# Altium schematic sheet Flight Controller Support Board.SchDoc
size A4; SheetNumber: 1; SheetTotal: 1
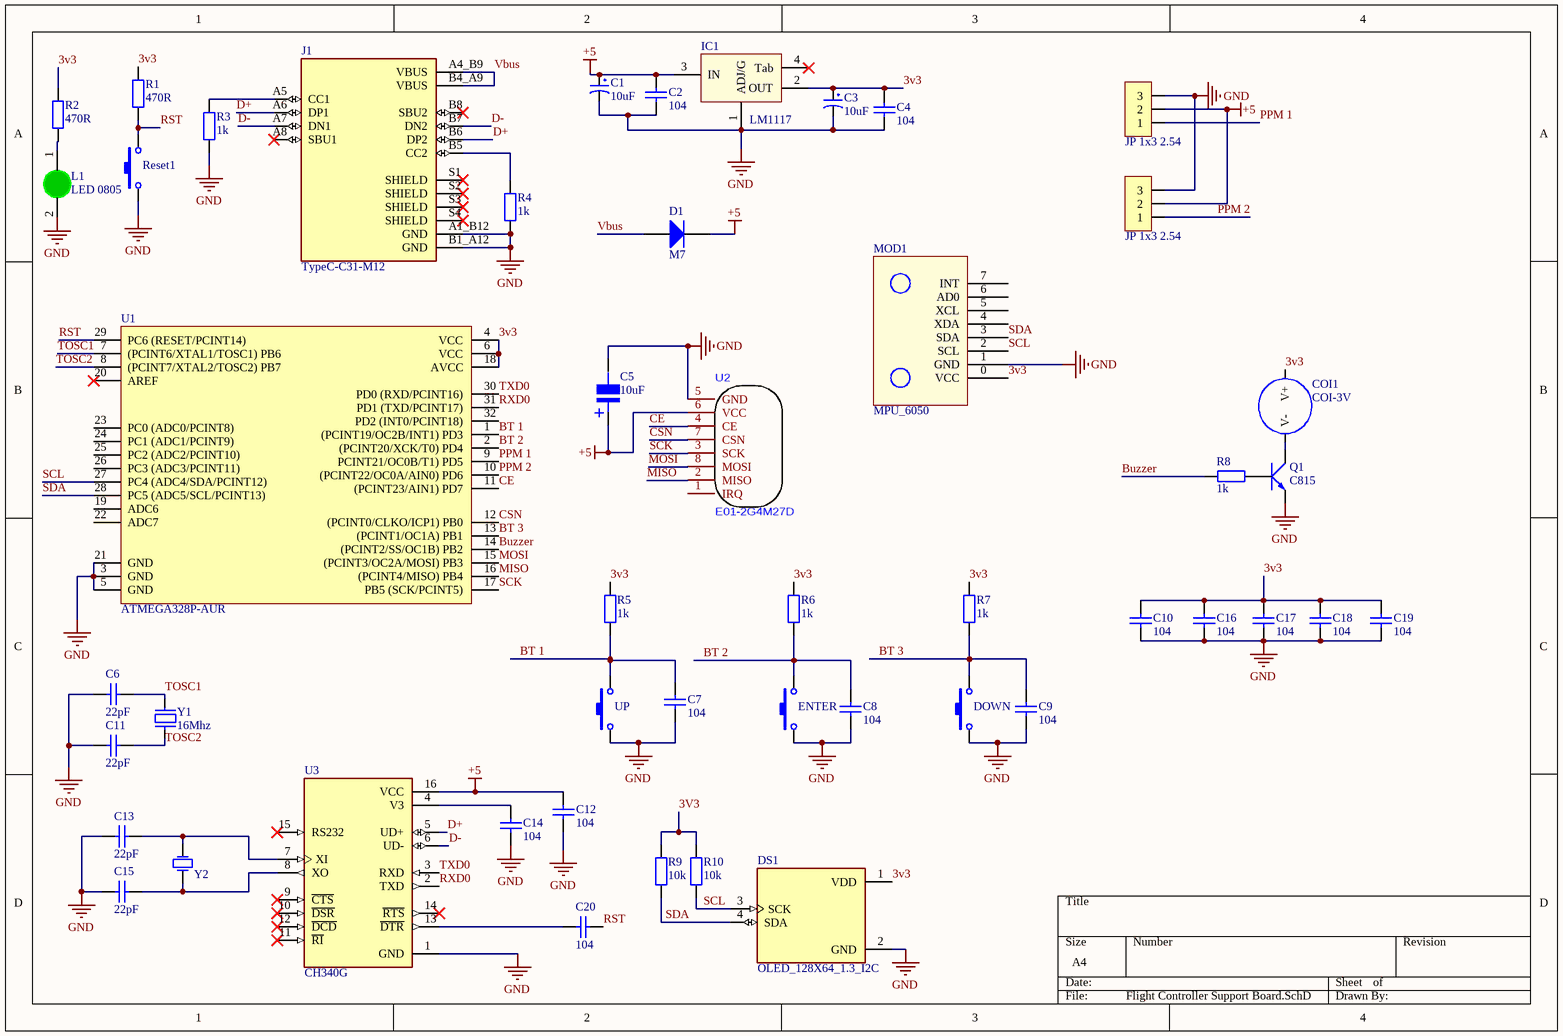
[diagram p0: Flight Controller Support Board.SchDoc]

## Parts
C1  10uF  [tu tantalum smd7343]
C2  104  [Cap 0603]
C3  10uF  [tu tantalum smd7343]
C4  104  [Cap 0603]
C5  10uF  [tu nhom 5 (c)]
C6  22pF  [tu 0603]
C7  104  [Cap 0603]
C8  104  [Cap 0603]
C9  104  [Cap 0603]
C10  104  [Cap 0603]
C11  22pF  [tu 0603]
C12  104  [Cap 0603]
C13  22pF  [tu 0603]
C14  104  [Cap 0603]
C15  22pF  [tu 0603]
C16  104  [Cap 0603]
C17  104  [Cap 0603]
C18  104  [Cap 0603]
C19  104  [Cap 0603]
C20  104  [Cap 0603]
COI1  COI-3V  [COI-CHIP - duplicate]
D1  M7  [DIODE SMA]
DOWN  Nut Nhan 2 Chan SMD 3x6x2.5  [Nut Nhan 2 Chan SMD 3x6x2.5]  (value not drawn)
DS1  OLED_128X64_1.3_I2C  [LCD_OLED_128X64_1.3_I2C]
ENTER  Nut Nhan 2 Chan SMD 3x6x2.5  [Nut Nhan 2 Chan SMD 3x6x2.5]  (value not drawn)
IC1  LM1117  [SOT223-4N]
J1  TypeC-C31-M12  [TypeC-C31-M12]
JP1  JP 1x3 2.54  [JP 1x3 CT]
JP2  JP 1x3 2.54  [JP 1x3 CT]
L1  LED 0805  [LED-0805-Green]
MOD1  MPU_6050  [MOD MPU-6050]
Q1  C815  [SOT-23]
R1  470R  [tro smd 0603]
R2  470R  [tro smd 0603]
R3  1k  [tro smd 0603]
R4  1k  [tro smd 0603]
R5  1k  [tro smd 0603]
R6  1k  [tro smd 0603]
R7  1k  [tro smd 0603]
R8  1k  [tro smd 0603]
R9  10k  [tro smd 0603]
R10  10k  [tro smd 0603]
Reset1  Nut Nhan 2 Chan SMD 3x6x2.5  [Nut Nhan 2 Chan SMD 3x6x2.5]  (value not drawn)
U1  ATMEGA328P-AUR  [TQFP-32]
U2  E01-2G4M27D  [E01-2G4M27D]
U3  CH340G  [CH340G]
UP  Nut Nhan 2 Chan SMD 3x6x2.5  [Nut Nhan 2 Chan SMD 3x6x2.5]  (value not drawn)
Y1  16Mhz  [Thach Anh 2 chan SMD]
Y2  32MHz  [THACH ANH DAN 3215]  (value not drawn)

## Nets
+5: C1.1 C2.1 C5.1 C12.1 D1.2(K) IC1.3(IN) JP1.2 JP2.2 U2.6(VCC) U3.16(VCC)
GND: C1.2 C2.2 C3.2 C4.2 C5.2 C6.2 C7.2 C8.2 C9.2 C10.2 C11.2 C12.2 C13.1 C14.2 C15.1 C16.2 C17.2 C18.2 C19.2 DOWN.1 DS1.2(GND) ENTER.1 IC1.1(ADJ/G) J1.A1_B12(GND) J1.B1_A12(GND) JP1.3 JP2.3 L1.2(K) MOD1.1(GND) Q1.2(E) R3.1 R4.1 Reset1.1 U1.3(GND) U1.5(GND) U1.21(GND) U2.5(GND) U3.1(GND) UP.1
3v3: C3.1 C4.1 C10.1 C16.1 C17.1 C18.1 C19.1 COI1.1(V+) DS1.1(VDD) IC1.2(OUT) MOD1.0(VCC) R1.2 R2.2 R5.2 R6.2 R7.2 R9.2 R10.2 U1.4(VCC) U1.6(VCC) U1.18(AVCC)
BT 1: C7.1 R5.1 U1.1((PCINT19/OC2B/INT1)_PD3) UP.2
BT 2: C8.1 ENTER.2 R6.1 U1.2((PCINT20/XCK/T0)_PD4)
BT 3: C9.1 DOWN.2 R7.1 U1.13((PCINT1/OC1A)_PB1)
Buzzer: R8.2 U1.14((PCINT2/SS/OC1B)_PB2)
CE: U1.11((PCINT23/AIN1)_PD7) U2.4(CE)
CSN: U1.12((PCINT0/CLKO/ICP1)_PB0) U2.7(CSN)
D+: J1.A6(DP1) J1.B6(DP2) U3.5(UD+)
D-: J1.A7(DN1) J1.B7(DN2) U3.6(UD-)
MISO: U1.16((PCINT4/MISO)_PB4) U2.2(MISO)
MOSI: U1.15((PCINT3/OC2A/MOSI)_PB3) U2.8(MOSI)
PPM 1: JP1.1 U1.9(PCINT21/OC0B/T1)_PD5)
PPM 2: JP2.1 U1.10((PCINT22/OC0A/AIN0)_PD6)
RST: C20.1 R1.1 Reset1.2 U1.29(PC6_(RESET/PCINT14))
RXD0: U1.31(PD1_(TXD/PCINT17)) U3.2(TXD)
SCK: U1.17(PB5_(SCK/PCINT5)) U2.3(SCK)
SCL: DS1.3(SCK) MOD1.2(SCL) R10.1 U1.27(PC4_(ADC4/SDA/PCINT12))
SDA: DS1.4(SDA) MOD1.3(SDA) R9.1 U1.28(PC5_(ADC5/SCL/PCINT13))
TOSC1: C6.1 U1.7((PCINT6/XTAL1/TOSC1)_PB6) Y1.2
TOSC2: C11.1 U1.8((PCINT7/XTAL2/TOSC2)_PB7) Y1.1
TXD0: U1.30(PD0_(RXD/PCINT16)) U3.3(RXD)
Vbus: D1.1(A) J1.A4_B9(VBUS) J1.B4_A9(VBUS)
NetC13_2: C13.2 U3.7(XI) Y2.1(OSC1)
NetC14_1: C14.1 U3.4(V3)
NetC15_2: C15.2 U3.8(XO) Y2.2(OSC2)
NetC20_2: C20.2 U3.13(~{DTR})
NetCOI1_2: COI1.2(V-) Q1.3(C)
NetJ1_A5: J1.A5(CC1) R3.2
NetJ1_B5: J1.B5(CC2) R4.2
NetL1_1: L1.1(A) R2.1
NetQ1_1: Q1.1(B) R8.1

Not connected (* = marked no-connect by the designer): IC1 4(Tab)*; J1 A8(SBU1)* B8(SBU2)* S1(SHIELD)* S2(SHIELD)* S3(SHIELD)* S4(SHIELD)*; MOD1 4(XDA) 5(XCL) 6(AD0) 7(INT); U1 19(ADC6) 20(AREF)* 22(ADC7) 23(PC0_(ADC0/PCINT8)) 24(PC1_(ADC1/PCINT9)) 25(PC2_(ADC2/PCINT10)) 26(PC3_(ADC3/PCINT11)) 32(PD2_(INT0/PCINT18)); U2 1(IRQ); U3 9(~{CTS})* 10(~{DSR})* 11(~{RI})* 12(~{DCD})* 14(~{RTS})* 15(RS232)*

## Notes on the sheet
- (in symbol Tu Nhom 10uF 50V) +

## Library data of the parts
C1 C3 = Tu tantalum 10uF 50V SMD7343: Dán; Don_Vi: Con; So_Chan: 2; Ten_Linh_Kien: Tụ tantalum 106T-10uF 50V SMD7343; Ma_Hang: MH006532; Chung_Loai: Dán; Kieu_Chan: *
C2 C4 C7-C10 C12 C14 C16-C20 = Tu 0603 104 50V 10%: SMD 0.1 µF (100 nF); Chung_Loai: Dán; Don_Vi: Con; So_Chan: 2; Ten_Linh_Kien: Tụ 0603 104-100nF 10% 50V; Ma_Hang: MH004568; Kieu_Chan: *
C5 = Tu Nhom 10uF 50V: Dán; Don_Vi: Con; So_Chan: 2; Ten_Linh_Kien: Tụ Nhôm 10uF 50V 5x5MM; Ma_Hang: MH002229; Chung_Loai: Dán; Kieu_Chan: *
C6 C11 C13 C15 = Tu 0603 22pF 50V 10%: SMD; Chung_Loai: Dán; Don_Vi: Con; So_Chan: 2; Ten_Linh_Kien: Tụ 0603 22pF 50V 10%; Ma_Hang: MH004570; Kieu_Chan: *
COI1 = COI-CHIP-3V
D1 = Diode M7 ( 4007 ): Dán; Don_Vi: Con; Ten_Linh_Kien: Diode M7 1N4007 SMD 1A 1000V; Ma_Hang: MH000944; Chung_Loai: Dán; Ghi_Chu: *
DOWN ENTER Reset1 UP = Nut Nhan 2 Chan SMD 3x6x2.5: Ma_Hang: MH001036; Ten: Nút Nhấn 2 Chân 3x6x2.5MM SMD
DS1 = OLED_128X64_1.3_I2C: Non-Touch Graphic LCD Display Module Transmissive White OLED, Monochrome I2C 1.3 (33.02mm) 128 x 64; MF: UNIVERSAL-SOLDER Electronics Ltd; MP: OLED 128x64 1.3&quot; I2C; SnapEDA_Link: https://www.snapeda.com/parts/OLED%20128x64%201.3%22%20I2C/UNIVERSAL-SOLDER+Electronics+Ltd/view-part/?ref=snap; Package: None; Value: *; Check_prices: https://www.snapeda.com/parts/OLED%20128x64%201.3%22%20I2C/UNIVERSAL-SOLDER+Electronics+Ltd/view-part/?ref=eda
IC1 = LM1117: 3v3; Value: LM317
J1 = TypeC-C31-M12: USB Connectors 24 Receptacle 1 8.94*7.3mm RoHS
JP1 JP2 = JP 1x3 2.54 Cai Thang: Cắm; Ten_Linh_Kien: Jump Đơn Cái 2.54MM 1x20P Thẳng; Don_Vi: Con; Ma_Hang: MH004006; Ghi_Chu: *; Kieu_Chan: *; Chung_Loai: Cắm
L1 = LED 0805 Xanh La: Dán; Don_Vi: Con; Ma_Hang: MH002326; Ten_Linh_Kien: LED 0805 Màu Xanh Lá (Green); Ghi_Chu: *; Kieu_Chan: *; Chung_Loai: Dán
Q1 = Trans C1815 HF SMD: SOT-23; Value: C9014
R1-R7 = Tro 0603 5% 100R: Dán; Don_Vi: Con; So_Chan: 2; Ten_Linh_Kien: Trở 0603 5% 100R; Ma_Hang: MH006315; Chung_Loai: Dán; Kieu_Chan: *
R8-R10 = Tro 0603 5% 10k: Dán; Don_Vi: Con; So_Chan: 2; Ten_Linh_Kien: Trở 0603 5% 10k; Ma_Hang: MH006316; Chung_Loai: Dán; Kieu_Chan: *
U1 = IC_ATMEGA328P: AVR AVR® ATmega Microcontroller IC 8-Bit 20MHz 32KB (16K x 16) FLASH 32-TQFP (7x7); Manufacturer: Microchip Technology; Alternate Part Number-1: NA; Manufacturer Part Number: ATMEGA328P-AUR; Case/Package: 32-TQFP; Supplier-1: Arrow; Supplier Part Number-1: ATMEGA328P-AUR
U2 = E01-2G4M27D: Ebyte E01-ML01DP5 is similar to NRF24L01 + PA + LNA. Those RF modules work at the same frequency (2.4GHz). The Ebyte E01-ML01DP5 is the better version and have more reliability and stability.
U3 = CH340G: USB Interface Integrated Circuit
Y1 = Thach Anh 2 chan SMD: Crystal For all Crystal 2pin.; Value: 4Mhz
Y2 = Thach Anh SMD 3225: C700805; Chung_Loai: Dán; Ten_Linh_Kien: Thạch Anh 16Mhz SMD5032; Ma_Hang: MH001979; Don_Vi: Con; Ghi_Chu: *; Kieu_Chan: *